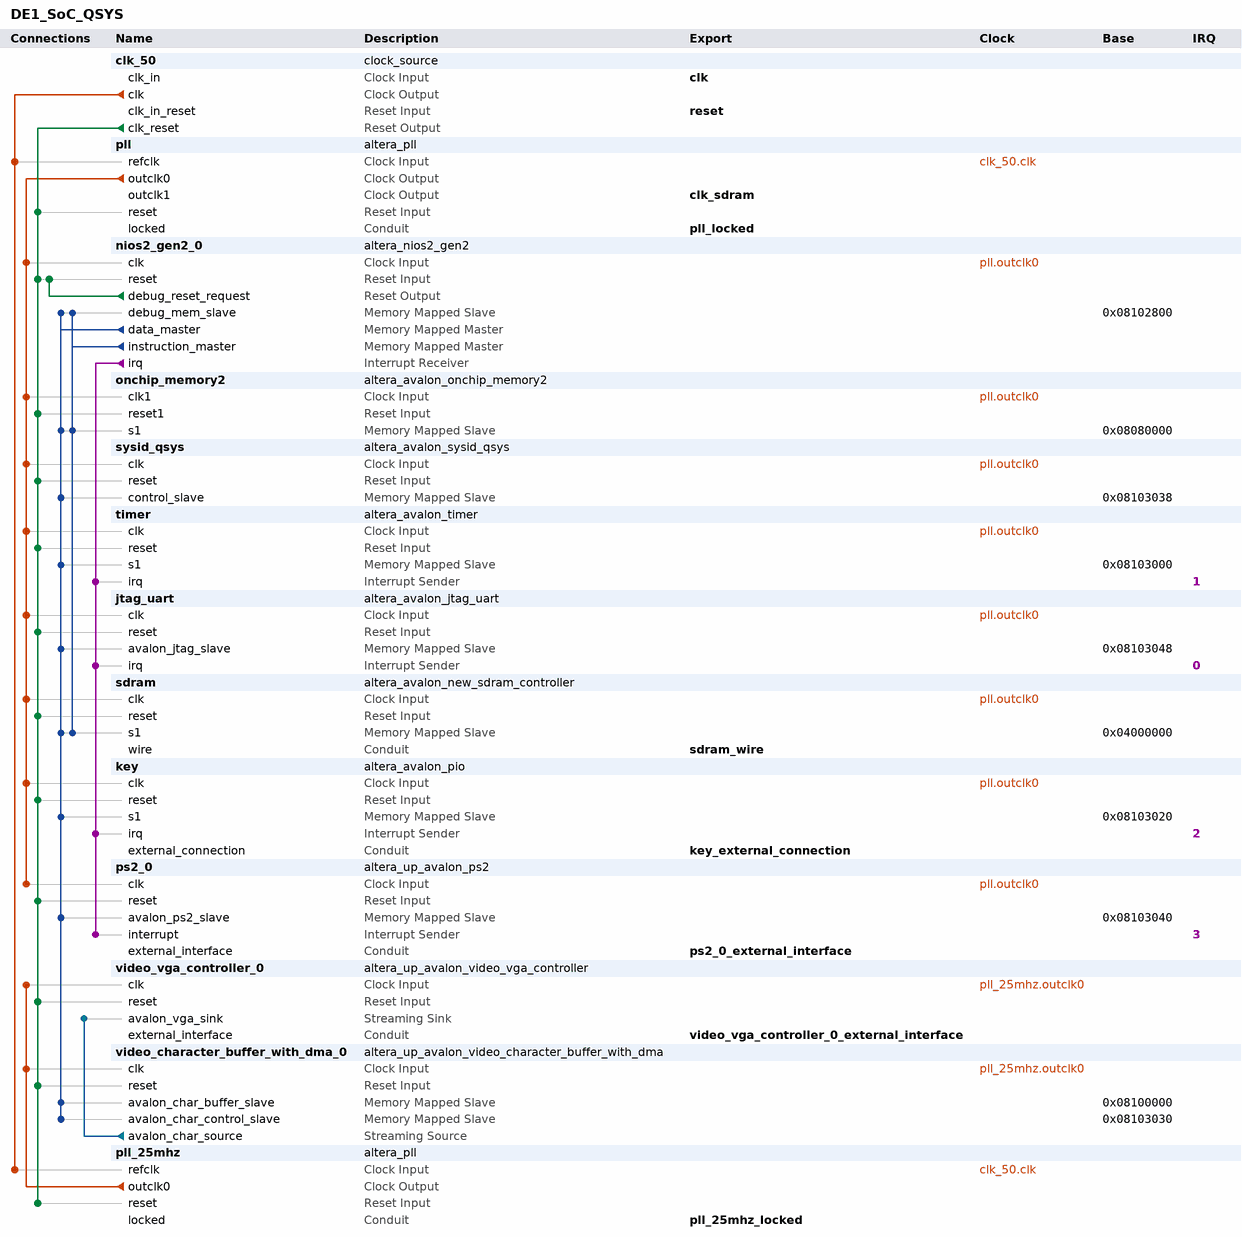
[diagram p0: system contents]
# Platform Designer (Qsys) system DE1_SoC_QSYS, Cyclone V 5CSEMA5F31C6
# Parameters at their usual value, and those the tool derives, are not listed.
package require -exact qsys 16.0
create_system DE1_SoC_QSYS
set_project_property DEVICE_FAMILY {Cyclone V}
set_project_property DEVICE 5CSEMA5F31C6

add_instance clk_50 clock_source 16.0
set_instance_parameter_value clk_50 clockFrequency 50000000

add_instance pll altera_pll 16.0
set_instance_parameter_value pll gui_device_speed_grade 2
set_instance_parameter_value pll gui_number_of_clocks 2
set_instance_parameter_value pll gui_operation_mode normal
set_instance_parameter_value pll gui_output_clock_frequency0 143.0
set_instance_parameter_value pll gui_output_clock_frequency1 143.0
set_instance_parameter_value pll gui_phase_shift1 -3800
set_instance_parameter_value pll gui_phase_shift_deg1 -90.0
set_instance_parameter_value pll gui_pll_mode {Integer-N PLL}
set_instance_parameter_value pll gui_reference_clock_frequency 50.0
set_instance_parameter_value pll gui_use_locked true

add_instance nios2_gen2_0 altera_nios2_gen2 16.0
set_instance_parameter_value nios2_gen2_0 dcache_size 2048
set_instance_parameter_value nios2_gen2_0 exceptionSlave sdram.s1
set_instance_parameter_value nios2_gen2_0 icache_size 4096
set_instance_parameter_value nios2_gen2_0 impl Fast
set_instance_parameter_value nios2_gen2_0 resetSlave sdram.s1

add_instance onchip_memory2 altera_avalon_onchip_memory2 16.0
set_instance_parameter_value onchip_memory2 dataWidth 32
set_instance_parameter_value onchip_memory2 dualPort false
set_instance_parameter_value onchip_memory2 initMemContent true
set_instance_parameter_value onchip_memory2 initializationFileName onchip_mem.hex
set_instance_parameter_value onchip_memory2 memorySize 320000

add_instance sysid_qsys altera_avalon_sysid_qsys 16.0
set_instance_parameter_value sysid_qsys id 0

add_instance timer altera_avalon_timer 16.0
set_instance_parameter_value timer period 1
set_instance_parameter_value timer periodUnits MSEC

add_instance jtag_uart altera_avalon_jtag_uart 16.0
set_instance_parameter_value jtag_uart simInteractiveOptions NO_INTERACTIVE_WINDOWS

add_instance sdram altera_avalon_new_sdram_controller 16.0
set_instance_parameter_value sdram TAC 5.4
set_instance_parameter_value sdram TRCD 15.0
set_instance_parameter_value sdram TRP 15.0
set_instance_parameter_value sdram casLatency 3
set_instance_parameter_value sdram columnWidth 10
set_instance_parameter_value sdram dataWidth 16
set_instance_parameter_value sdram generateSimulationModel true
set_instance_parameter_value sdram model single_Micron_MT48LC4M32B2_7_chip
set_instance_parameter_value sdram numberOfBanks 4
set_instance_parameter_value sdram numberOfChipSelects 1
set_instance_parameter_value sdram powerUpDelay 100.0
set_instance_parameter_value sdram refreshPeriod 7.8125
set_instance_parameter_value sdram rowWidth 13

add_instance key altera_avalon_pio 16.0
set_instance_parameter_value key captureEdge true
set_instance_parameter_value key direction Input
set_instance_parameter_value key edgeType FALLING
set_instance_parameter_value key generateIRQ true
set_instance_parameter_value key irqType EDGE
set_instance_parameter_value key simDoTestBenchWiring true
set_instance_parameter_value key simDrivenValue 15
set_instance_parameter_value key width 4

add_instance ps2_0 altera_up_avalon_ps2 15.1

add_instance video_vga_controller_0 altera_up_avalon_video_vga_controller 15.1
set_instance_parameter_value video_vga_controller_0 board DE1-SoC
set_instance_parameter_value video_vga_controller_0 resolution {VGA 640x480}

add_instance video_character_buffer_with_dma_0 altera_up_avalon_video_character_buffer_with_dma 15.1
set_instance_parameter_value video_character_buffer_with_dma_0 enable_transparency false

add_instance pll_25mhz altera_pll 16.0
set_instance_parameter_value pll_25mhz gui_device_speed_grade 2
set_instance_parameter_value pll_25mhz gui_number_of_clocks 1
set_instance_parameter_value pll_25mhz gui_operation_mode normal
set_instance_parameter_value pll_25mhz gui_output_clock_frequency0 25.0
set_instance_parameter_value pll_25mhz gui_pll_mode {Integer-N PLL}
set_instance_parameter_value pll_25mhz gui_reference_clock_frequency 50.0
set_instance_parameter_value pll_25mhz gui_use_locked true

# connections
add_connection clk_50.clk pll.refclk clock
add_connection clk_50.clk pll_25mhz.refclk clock
add_connection pll.outclk0 jtag_uart.clk clock
add_connection pll.outclk0 key.clk clock
add_connection pll.outclk0 nios2_gen2_0.clk clock
add_connection pll.outclk0 onchip_memory2.clk1 clock
add_connection pll.outclk0 ps2_0.clk clock
add_connection pll.outclk0 sdram.clk clock
add_connection pll.outclk0 sysid_qsys.clk clock
add_connection pll.outclk0 timer.clk clock
add_connection pll_25mhz.outclk0 video_character_buffer_with_dma_0.clk clock
add_connection pll_25mhz.outclk0 video_vga_controller_0.clk clock
add_connection clk_50.clk_reset jtag_uart.reset reset
add_connection clk_50.clk_reset key.reset reset
add_connection clk_50.clk_reset nios2_gen2_0.reset reset
add_connection clk_50.clk_reset onchip_memory2.reset1 reset
add_connection clk_50.clk_reset pll.reset reset
add_connection clk_50.clk_reset pll_25mhz.reset reset
add_connection clk_50.clk_reset ps2_0.reset reset
add_connection clk_50.clk_reset sdram.reset reset
add_connection clk_50.clk_reset sysid_qsys.reset reset
add_connection clk_50.clk_reset timer.reset reset
add_connection clk_50.clk_reset video_character_buffer_with_dma_0.reset reset
add_connection clk_50.clk_reset video_vga_controller_0.reset reset
add_connection nios2_gen2_0.debug_reset_request nios2_gen2_0.reset reset
add_connection nios2_gen2_0.data_master jtag_uart.avalon_jtag_slave avalon
set_connection_parameter_value nios2_gen2_0.data_master/jtag_uart.avalon_jtag_slave baseAddress 0x08103048
add_connection nios2_gen2_0.data_master key.s1 avalon
set_connection_parameter_value nios2_gen2_0.data_master/key.s1 baseAddress 0x08103020
add_connection nios2_gen2_0.data_master nios2_gen2_0.debug_mem_slave avalon
set_connection_parameter_value nios2_gen2_0.data_master/nios2_gen2_0.debug_mem_slave baseAddress 0x08102800
add_connection nios2_gen2_0.data_master onchip_memory2.s1 avalon
set_connection_parameter_value nios2_gen2_0.data_master/onchip_memory2.s1 baseAddress 0x08080000
add_connection nios2_gen2_0.data_master ps2_0.avalon_ps2_slave avalon
set_connection_parameter_value nios2_gen2_0.data_master/ps2_0.avalon_ps2_slave baseAddress 0x08103040
add_connection nios2_gen2_0.data_master sdram.s1 avalon
set_connection_parameter_value nios2_gen2_0.data_master/sdram.s1 baseAddress 0x04000000
add_connection nios2_gen2_0.data_master sysid_qsys.control_slave avalon
set_connection_parameter_value nios2_gen2_0.data_master/sysid_qsys.control_slave baseAddress 0x08103038
add_connection nios2_gen2_0.data_master timer.s1 avalon
set_connection_parameter_value nios2_gen2_0.data_master/timer.s1 baseAddress 0x08103000
add_connection nios2_gen2_0.data_master video_character_buffer_with_dma_0.avalon_char_buffer_slave avalon
set_connection_parameter_value nios2_gen2_0.data_master/video_character_buffer_with_dma_0.avalon_char_buffer_slave baseAddress 0x08100000
add_connection nios2_gen2_0.data_master video_character_buffer_with_dma_0.avalon_char_control_slave avalon
set_connection_parameter_value nios2_gen2_0.data_master/video_character_buffer_with_dma_0.avalon_char_control_slave baseAddress 0x08103030
add_connection nios2_gen2_0.instruction_master nios2_gen2_0.debug_mem_slave avalon
set_connection_parameter_value nios2_gen2_0.instruction_master/nios2_gen2_0.debug_mem_slave baseAddress 0x08102800
add_connection nios2_gen2_0.instruction_master onchip_memory2.s1 avalon
set_connection_parameter_value nios2_gen2_0.instruction_master/onchip_memory2.s1 baseAddress 0x08080000
add_connection nios2_gen2_0.instruction_master sdram.s1 avalon
set_connection_parameter_value nios2_gen2_0.instruction_master/sdram.s1 baseAddress 0x04000000
add_connection video_character_buffer_with_dma_0.avalon_char_source video_vga_controller_0.avalon_vga_sink avalon_streaming
add_connection nios2_gen2_0.irq jtag_uart.irq interrupt
set_connection_parameter_value nios2_gen2_0.irq/jtag_uart.irq irqNumber 0
add_connection nios2_gen2_0.irq key.irq interrupt
set_connection_parameter_value nios2_gen2_0.irq/key.irq irqNumber 2
add_connection nios2_gen2_0.irq ps2_0.interrupt interrupt
set_connection_parameter_value nios2_gen2_0.irq/ps2_0.interrupt irqNumber 3
add_connection nios2_gen2_0.irq timer.irq interrupt
set_connection_parameter_value nios2_gen2_0.irq/timer.irq irqNumber 1

# exported interfaces
add_interface clk clock sink
set_interface_property clk EXPORT_OF clk_50.clk_in
add_interface clk_sdram clock source
set_interface_property clk_sdram EXPORT_OF pll.outclk1
add_interface key_external_connection conduit end
set_interface_property key_external_connection EXPORT_OF key.external_connection
add_interface pll_25mhz_locked conduit end
set_interface_property pll_25mhz_locked EXPORT_OF pll_25mhz.locked
add_interface pll_locked conduit end
set_interface_property pll_locked EXPORT_OF pll.locked
add_interface ps2_0_external_interface conduit end
set_interface_property ps2_0_external_interface EXPORT_OF ps2_0.external_interface
add_interface reset reset sink
set_interface_property reset EXPORT_OF clk_50.clk_in_reset
add_interface sdram_wire conduit end
set_interface_property sdram_wire EXPORT_OF sdram.wire
add_interface video_vga_controller_0_external_interface conduit end
set_interface_property video_vga_controller_0_external_interface EXPORT_OF video_vga_controller_0.external_interface

set_interconnect_requirement {$system} qsys_mm.clockCrossingAdapter HANDSHAKE
set_interconnect_requirement {$system} qsys_mm.maxAdditionalLatency 1

save_system DE1_SoC_QSYS.qsys
